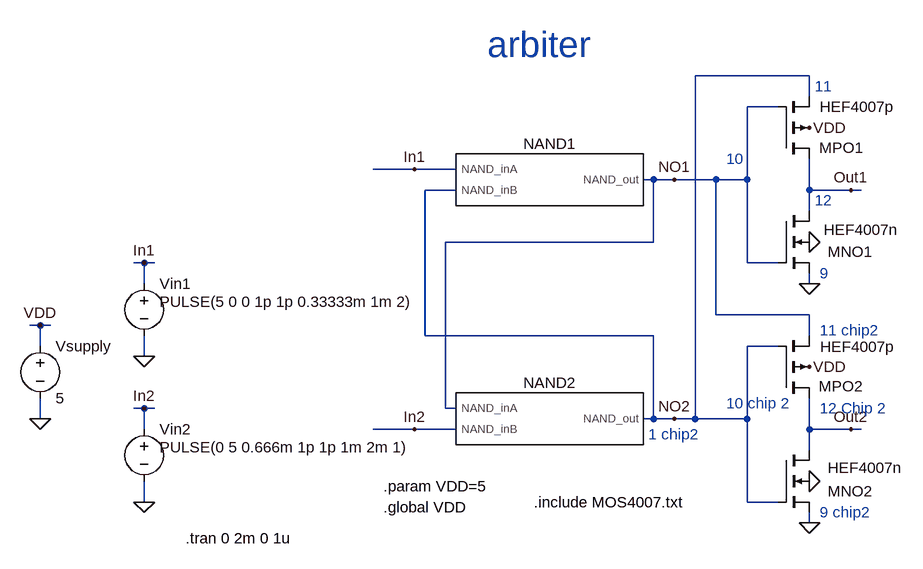
[diagram p0: schematic arbiter 1,1.asc]
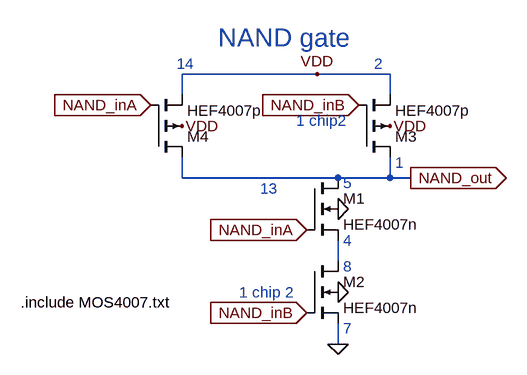
[diagram p1: sub-circuit nand.asc]
arbiter 1,1.asc, the LTspice schematic file:
Version 4
SHEET 1 1412 708
WIRE 592 -48 416 -48
WIRE 592 -16 592 -48
WIRE 544 0 496 0
WIRE -16 96 -80 96
WIRE 48 96 -16 96
WIRE 352 112 336 112
WIRE 384 112 352 112
WIRE 448 112 384 112
WIRE 496 112 496 0
WIRE 496 112 448 112
WIRE 48 128 0 128
WIRE 592 128 592 80
WIRE 656 128 592 128
WIRE 672 128 656 128
WIRE 592 160 592 128
WIRE 352 208 352 112
WIRE 352 208 32 208
WIRE -432 240 -448 240
WIRE -416 240 -432 240
WIRE 496 240 496 112
WIRE 544 240 496 240
WIRE -432 272 -432 240
WIRE 592 272 592 256
WIRE 448 320 448 112
WIRE 592 320 448 320
WIRE -592 336 -608 336
WIRE -576 336 -592 336
WIRE 0 352 0 128
WIRE 352 352 0 352
WIRE 592 352 592 320
WIRE -592 368 -592 336
WIRE 544 368 496 368
WIRE -432 384 -432 352
WIRE -432 464 -448 464
WIRE -416 464 -432 464
WIRE 32 464 32 208
WIRE 48 464 32 464
WIRE -592 480 -592 448
WIRE 352 480 352 352
WIRE 352 480 336 480
WIRE 384 480 352 480
WIRE 416 480 416 -48
WIRE 416 480 384 480
WIRE 496 480 496 368
WIRE 496 480 416 480
WIRE -432 496 -432 464
WIRE -16 496 -80 496
WIRE 48 496 -16 496
WIRE 592 496 592 448
WIRE 656 496 592 496
WIRE 672 496 656 496
WIRE 592 528 592 496
WIRE -432 608 -432 576
WIRE 496 608 496 480
WIRE 544 608 496 608
WIRE 592 640 592 624
FLAG 592 400 VDD
FLAG 592 576 0
FLAG -592 480 0
FLAG -432 384 0
FLAG -432 608 0
FLAG 592 32 VDD
FLAG 592 208 0
FLAG 592 640 0
FLAG 592 272 0
FLAG -16 96 In1
FLAG -16 496 In2
FLAG 656 128 Out1
FLAG 656 496 Out2
FLAG -432 240 In1
FLAG -432 464 In2
FLAG -592 336 VDD
FLAG 384 112 NO1
FLAG 384 480 NO2
SYMBOL nmos4 544 528 R0
WINDOW 0 76 63 Left 2
WINDOW 3 76 27 Left 2
SYMATTR InstName MNO2
SYMATTR Value HEF4007n
SYMBOL pmos4 544 448 M180
WINDOW 0 62 18 Left 2
WINDOW 3 65 79 Left 2
SYMATTR InstName MPO2
SYMATTR Value HEF4007p
SYMBOL voltage -592 352 R0
WINDOW 123 0 0 Left 2
WINDOW 39 0 0 Left 2
SYMATTR InstName Vsupply
SYMATTR Value 5
SYMBOL voltage -432 256 R0
WINDOW 123 0 0 Left 2
WINDOW 39 0 0 Left 2
WINDOW 3 24 44 Left 2
SYMATTR Value PULSE(5 0 0 1p 1p 0.33333m 1m 2)
SYMATTR InstName Vin1
SYMBOL voltage -432 480 R0
WINDOW 123 0 0 Left 2
WINDOW 39 0 0 Left 2
WINDOW 3 24 44 Left 2
SYMATTR Value PULSE(0 5 0.666m 1p 1p 1m 2m 1)
SYMATTR InstName Vin2
SYMBOL NAND 192 112 R0
SYMATTR InstName NAND1
SYMBOL NAND 192 480 R0
SYMATTR InstName NAND2
SYMBOL pmos4 544 80 M180
WINDOW 0 63 17 Left 2
WINDOW 3 64 80 Left 2
SYMATTR InstName MPO1
SYMATTR Value HEF4007p
SYMBOL nmos4 544 160 R0
WINDOW 0 76 63 Left 2
WINDOW 3 70 29 Left 2
SYMATTR InstName MNO1
SYMATTR Value HEF4007n
TEXT 168 608 Left 2 !.include MOS4007.txt
TEXT 96 -96 Left 5 ;arbiter
TEXT -64 584 Left 2 !.param VDD=5
TEXT -64 616 Left 2 !.global VDD
TEXT 344 504 Left 2 ;1 chip2
TEXT 600 -32 Left 2 ;11
TEXT 600 144 Left 2 ;12
TEXT 608 256 Left 2 ;9
TEXT 464 80 Left 2 ;10
TEXT 608 344 Left 2 ;11 chip2
TEXT 464 456 Left 2 ;10 chip 2
TEXT 608 464 Left 2 ;12 Chip 2
TEXT 608 624 Left 2 ;9 chip2
TEXT -368 664 Left 2 !.tran 0 2m 0 1u

nand.asc, the sub-circuit schematic file:
Version 4
SHEET 1 880 680
WIRE 192 -112 -16 -112
WIRE 304 -112 192 -112
WIRE -16 -80 -16 -112
WIRE 304 -80 304 -112
WIRE -16 48 -16 16
WIRE 224 48 -16 48
WIRE 304 48 304 16
WIRE 304 48 224 48
WIRE 336 48 304 48
WIRE 224 176 224 144
WIRE 224 304 224 272
FLAG 304 -32 VDD
FLAG -16 -32 VDD
FLAG -64 -64 NAND_inA
IOPIN -64 -64 In
FLAG 176 128 NAND_inA
IOPIN 176 128 In
FLAG 256 -64 NAND_inB
IOPIN 256 -64 In
FLAG 176 256 NAND_inB
IOPIN 176 256 In
FLAG 336 48 NAND_out
IOPIN 336 48 Out
FLAG 224 224 0
FLAG 224 304 0
FLAG 192 -112 VDD
FLAG 224 96 0
SYMBOL nmos4 176 48 R0
SYMATTR InstName M1
SYMATTR Value HEF4007n
SYMBOL nmos4 176 176 R0
SYMATTR InstName M2
SYMATTR Value HEF4007n
SYMBOL pmos4 256 16 M180
SYMATTR InstName M3
SYMATTR Value HEF4007p
SYMBOL pmos4 -64 16 M180
SYMATTR InstName M4
SYMATTR Value HEF4007p
TEXT -264 240 Left 2 !.include MOS4007.txt
TEXT 40 -168 Left 4 ;NAND gate
TEXT -24 -128 Left 2 ;14
TEXT 280 -128 Left 2 ;2
TEXT 104 64 Left 2 ;13
TEXT 312 24 Left 2 ;1
TEXT 232 56 Left 2 ;5
TEXT 232 144 Left 2 ;4
TEXT 232 184 Left 2 ;8
TEXT 232 280 Left 2 ;7
TEXT 160 -40 Left 2 ;1 chip2
TEXT 72 224 Left 2 ;1 chip 2

The netlist it stands for:
* arbiter 1,1.asc
MNO2 Out2 NO2 0 0 HEF4007n
MPO2 Out2 NO2 NO1 VDD HEF4007p
Vsupply VDD 0 5
Vin1 In1 0 PULSE(5 0 0 1p 1p 0.33333m 1m 2)
Vin2 In2 0 PULSE(0 5 0.666m 1p 1p 1m 2m 1)
XNAND1 In1 NO2 NO1 nand
XNAND2 NO1 In2 NO2 nand
MPO1 Out1 NO1 NO2 VDD HEF4007p
MNO1 Out1 NO1 0 0 HEF4007n

* block symbol definitions
.subckt nand NAND_inA NAND_inB NAND_out
M1 NAND_out NAND_inA N001 0 HEF4007n
M2 N001 NAND_inB 0 0 HEF4007n
M3 NAND_out NAND_inB VDD VDD HEF4007p
M4 NAND_out NAND_inA VDD VDD HEF4007p
.include MOS4007.txt
* NAND gate
* 14
* 2
* 13
* 1
* 5
* 4
* 8
* 7
* 1 chip2
* 1 chip 2
.ends nand

.model NMOS NMOS
.model PMOS PMOS
.lib standard.mos
.include MOS4007.txt
* arbiter
.param VDD=5
.global VDD
* 1 chip2
* 11
* 12
* 9
* 10
* 11 chip2
* 10 chip 2
* 12 Chip 2
* 9 chip2
.tran 0 2m 0 1u
.backanno
.end